# Altium schematic sheet Accumulator_Overview.SchDoc
size A1
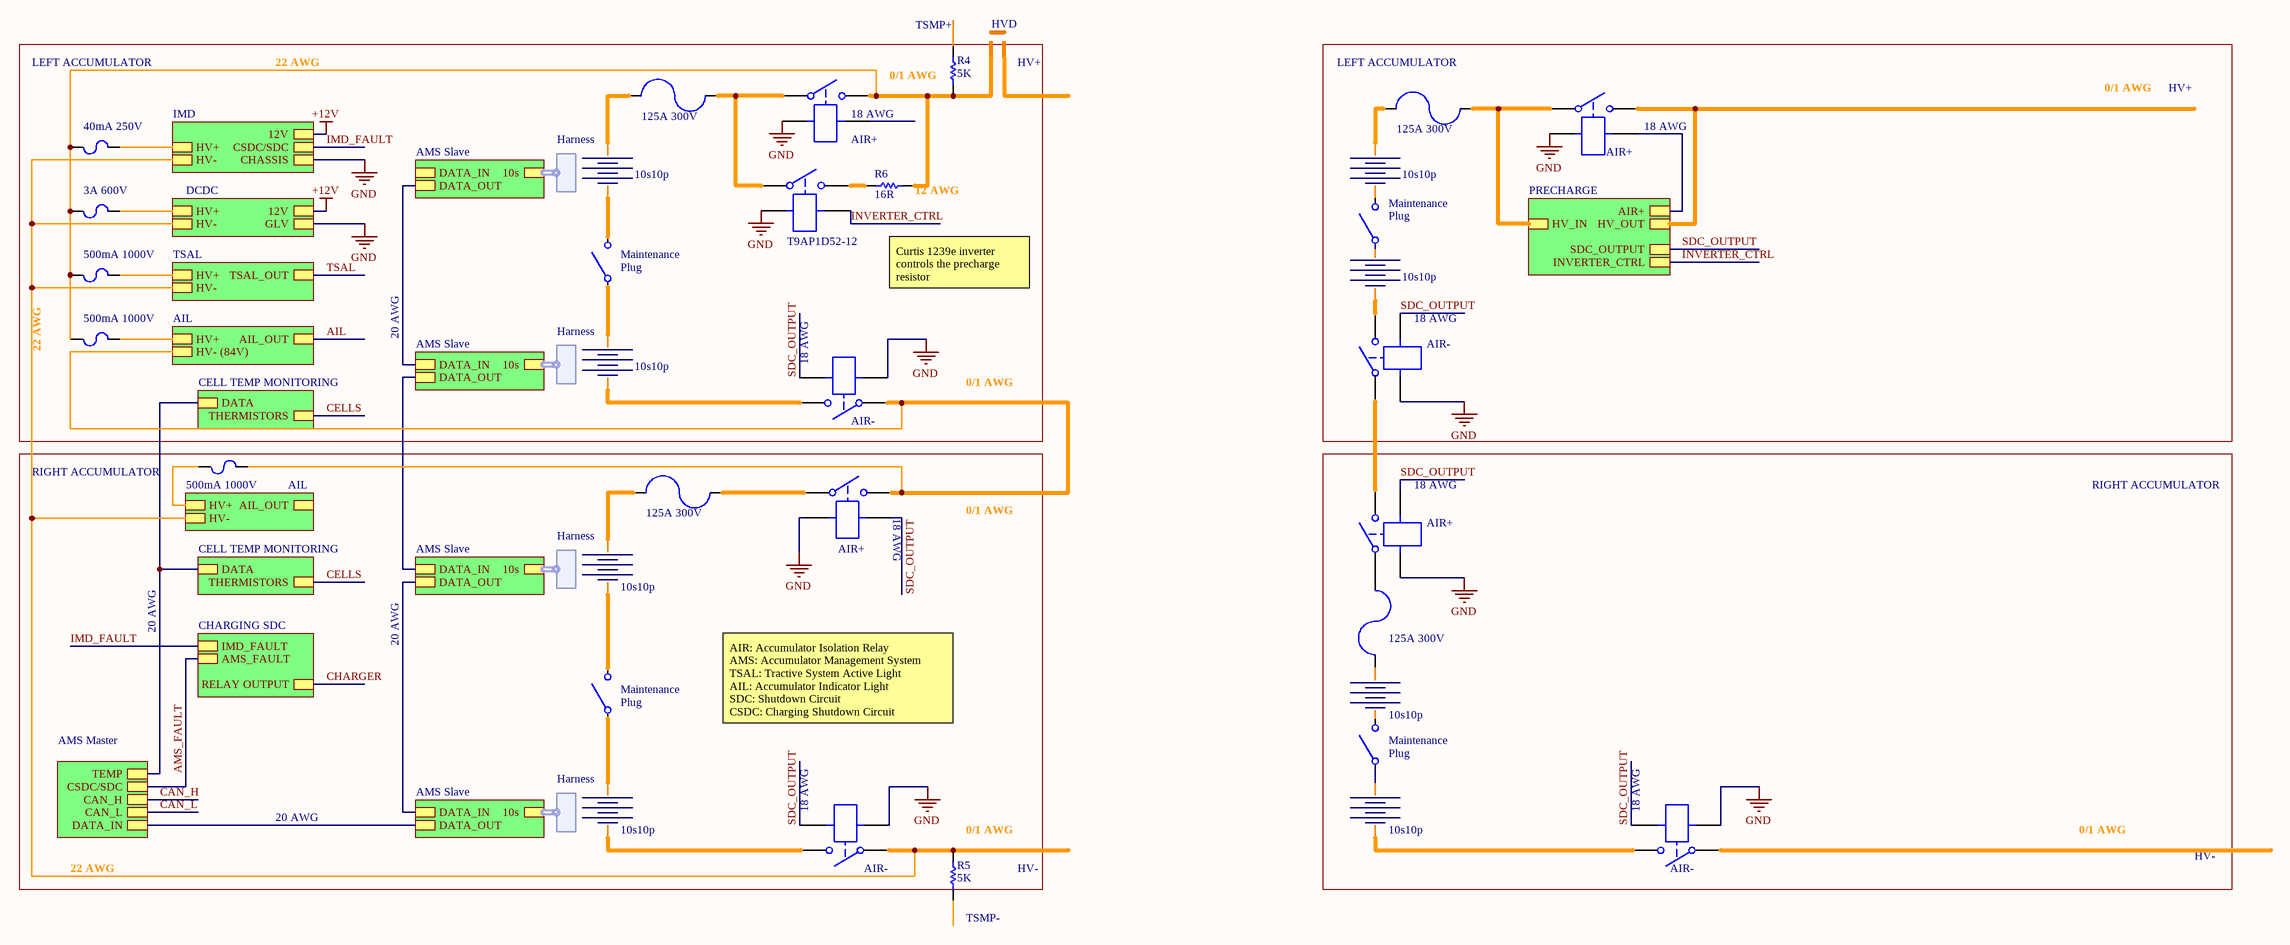
[diagram p0: Accumulator_Overview.SchDoc]

## Parts
1  125A 300V
2  125A 300V
3  AIR+
3A_600V  3A 600V
4  10s10p
5  125A 300V
6  AIR+
7  125A 300V
8  10s10p
9  10s10p
10s10p  10s10p
18  10s10p
19  10s10p
45  AIR-
*  500mA 1000V
*1  T9AP1D52-12
*2  500mA 1000V
*3  AIR+
*4  AIR-
*5  HVD
*6  AIR+
*7  AIR-
*8  AIR-
*9  40mA 250V
*10  500mA 1000V
Battery  10s10p
Battery2  10s10p
Plug  Maintenance_Plug  (value not drawn)
Plug1  Maintenance_Plug  (value not drawn)
Plug2  Maintenance_Plug  (value not drawn)
Plug3  Maintenance_Plug  (value not drawn)
R4  5K
R5  5K
R6  16R

## Sub-sheets
AIL = File Name: HV+, HV- (84V), AIL_OUT
AIL = File Name: HV+, HV-, AIL_OUT
AMS Master = File Name: CAN_H, DATA_IN, CAN_L, CSDC/SDC, TEMP
AMS Slave = File Name: 10s (harness Harness), DATA_OUT, DATA_IN
AMS Slave = File Name: 10s (harness Harness), DATA_OUT, DATA_IN
AMS Slave = File Name: 10s (harness Harness), DATA_OUT, DATA_IN
AMS Slave = File Name: 10s (harness Harness), DATA_OUT, DATA_IN
CELL TEMP MONITORING = File Name: THERMISTORS, DATA
CELL TEMP MONITORING = File Name: THERMISTORS, DATA
CHARGING SDC = File Name: RELAY OUTPUT, IMD_FAULT, AMS_FAULT
DCDC = File Name: HV+, HV-, 12V, GLV
IMD = File Name: HV+, HV-, 12V, CHASSIS, CSDC/SDC
PRECHARGE = File Name: SDC_OUTPUT, HV_IN, HV_OUT, INVERTER_CTRL, AIR+
TSAL = File Name: HV+, HV-, TSAL_OUT

## Harnesses
Harness: 

## Nets
+12V: sheet IMD/12V, sheet DCDC/12V
GND: 3.4 6.4 45.4 *1.4 *3.4 *4.4 *6.4 *7.4 *8.4 ; sheet IMD/CHASSIS, sheet DCDC/GLV
AIL: sheet AIL/AIL_OUT
AMS_FAULT: sheet AMS Master/CSDC/SDC, sheet CHARGING SDC/AMS_FAULT
CAN_H: sheet AMS Master/CAN_H
CAN_L: sheet AMS Master/CAN_L
CELLS: sheet CELL TEMP MONITORING/THERMISTORS, sheet CELL TEMP MONITORING/THERMISTORS
CHARGER: sheet CHARGING SDC/RELAY OUTPUT
IMD_FAULT: sheet IMD/CSDC/SDC, sheet CHARGING SDC/IMD_FAULT
INVERTER_CTRL: *1.4 ; sheet PRECHARGE/INVERTER_CTRL
SDC_OUTPUT: 3.4 6.4 45.4 *4.4 *7.4 *8.4 ; sheet PRECHARGE/SDC_OUTPUT
TSAL: sheet TSAL/TSAL_OUT
Net1_1: 1.1 Battery.1
Net1_2: 1.2 *1.4 *3.4
Net2_1: 2.1 Battery2.1
Net2_2: 2.2 *6.4 ; sheet PRECHARGE/HV_IN
Net3_4: 3.4 5.2
Net3_4: 3.4 45.4 *10.2 ; sheet AIL/HV- (84V)  [a separate net that carries the same name]
Net3A_600V_1: 3A_600V.1 *.1 *2.1 *3.4 *9.1 R4.1 R6.1
Net3A_600V_2: 3A_600V.2 ; sheet DCDC/HV+
Net4_1: 4.1 Plug2.4
Net4_2: 4.2 *7.4
Net5_1: 5.1 10s10p.1
Net6_4: 6.4 7.2
Net6_4: 6.4 *7.4  [a separate net that carries the same name]
Net7_1: 7.1 8.1
Net9_1: 9.1 Plug3.4
Net9_2: 9.2 *8.4
Net10s10p_2: 10s10p.2 Plug.4
Net18_1: 18.1 Plug.4
Net18_2: 18.2 *4.4
Net19_1: 19.1 Plug1.4
Net19_2: 19.2 45.4
Net*2_2: *2.2 ; sheet AIL/HV+
Net*4_4: *4.4 R5.2 ; sheet IMD/HV-, sheet DCDC/HV-, sheet TSAL/HV-, sheet AIL/HV-
Net*6_4: *6.4 ; sheet PRECHARGE/HV_OUT
Net*6_4: *6.4 ; sheet PRECHARGE/AIR+  [a separate net that carries the same name]
Net*9_2: *9.2 ; sheet IMD/HV+
Net*10_1: *10.1 ; sheet AIL/HV+
Net*_2: *.2 ; sheet TSAL/HV+
NetBattery2_2: Battery2.2 Plug2.4
NetBattery_2: Battery.2 Plug1.4
(unnamed): sheet AMS Master/DATA_IN, sheet AMS Slave/DATA_OUT
(unnamed): sheet AMS Master/TEMP, sheet CELL TEMP MONITORING/DATA, sheet CELL TEMP MONITORING/DATA
(unnamed): sheet AMS Slave/DATA_IN, sheet AMS Slave/DATA_OUT
(unnamed): sheet AMS Slave/DATA_IN, sheet AMS Slave/DATA_OUT
(unnamed): sheet AMS Slave/DATA_IN, sheet AMS Slave/DATA_OUT

Not connected (* = marked no-connect by the designer): 8 2; R4 2; R5 1; R6 2

## Notes on the sheet
- LEFT ACCUMULATOR
- 22 AWG
- (near R4) 0/1 AWG
- (near R4) TSMP+
- (near *5) HV+
- (near 2) LEFT ACCUMULATOR
- (near *3) 18 AWG
- (near *6) 18 AWG
- 0/1 AWG
- HV+
- (near R6) 12 AWG
- Maintenance
- (near Plug1) Maintenance
- (near Plug1) Plug
- (near Plug2) Plug
- 20 AWG
- Curtis 1239e inverter controls the precharge resistor
- (near *7) 18 AWG
- (near 45) 18 AWG
- RIGHT ACCUMULATOR
- (near 3) 18 AWG
- (near 6) 18 AWG
- (near Plug) Maintenance
- (near Plug) Plug
- AIR: Accumulator Isolation Relay
  AMS: Accumulator Management System
  TSAL: Tractive System Active Light
  AIL: Accumulator Indicator Light
  SDC: Shutdown Circuit
  CSDC: Charging Shutdown Circuit
- (near Plug3) Maintenance
- (near Plug3) Plug
- (near *4) 18 AWG
- (near R5) 0/1 AWG
- (near *8) 18 AWG
- HV-
- (near R5) TSMP-

## Library data of the parts
1 2 5 7 = FUSE
3 6 45 *1 *3 *4 *6-*8 = AIR_Detailed
3A_600V * *2 *9 *10 = FUSE_MINI
4 8 9 10s10p 18 19 Battery Battery2 = Battery
R4-R6 = RES